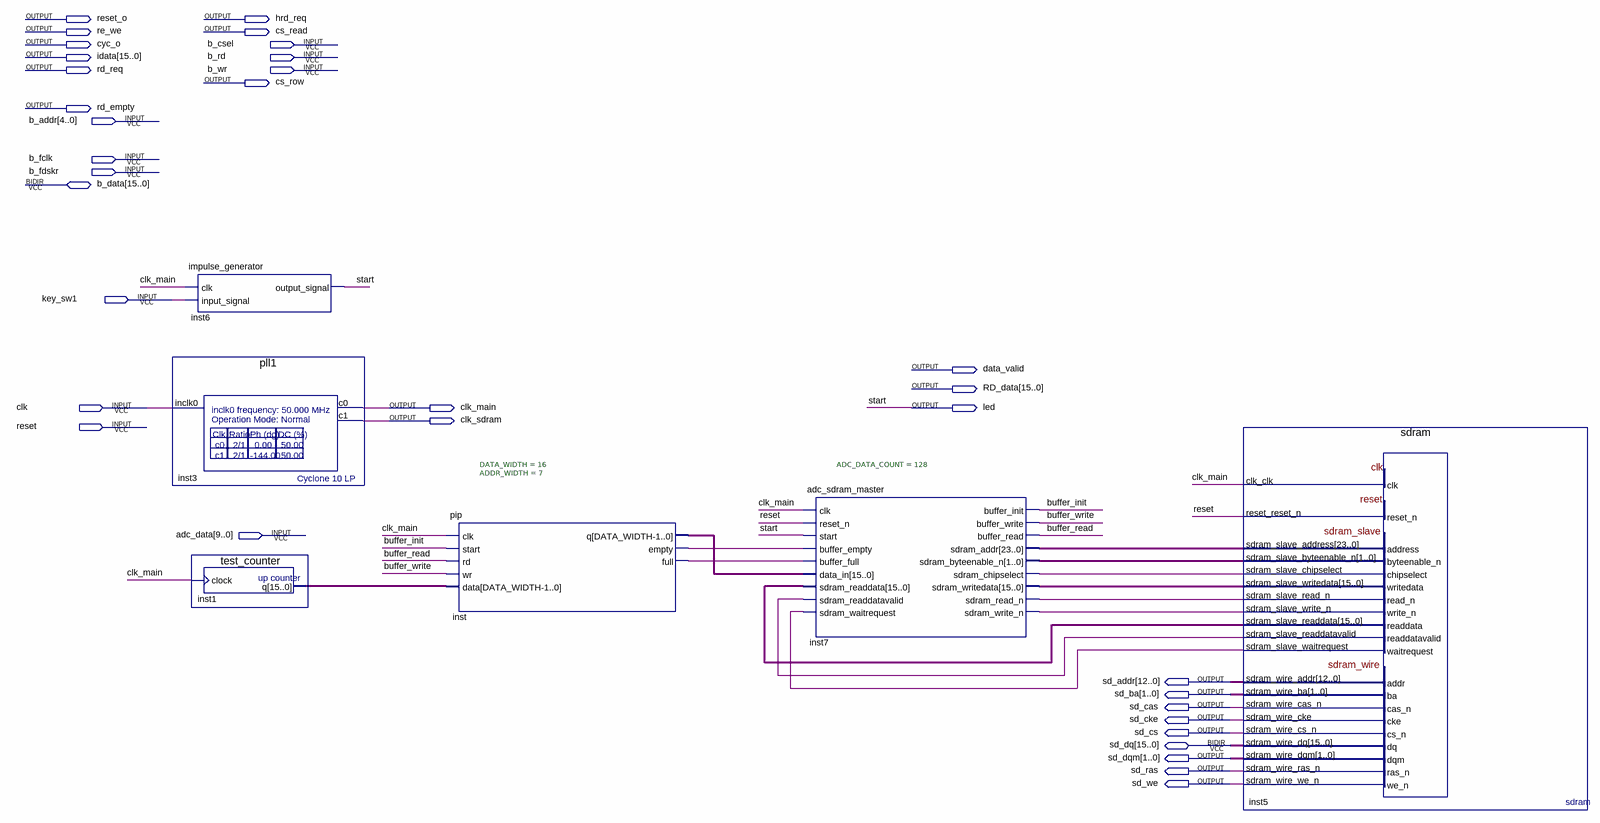
[diagram p0: schematic sheet]
// Quartus schematic burst.bdf as structural Verilog: 6 symbols, 34 pins
module burst (
  input  b_csel,
  input  b_rd,
  input  b_wr,
  input  [4:0] b_addr,
  input  b_fclk,
  input  b_fdskr,
  input  key_sw1,
  input  clk,
  input  reset,
  input  [9:0] adc_data,
  inout  [15:0] b_data,
  inout  [15:0] sd_dq,
  output reset_o,
  output hrd_req,
  output re_we,
  output cs_read,
  output cyc_o,
  output [15:0] idata,
  output rd_req,
  output cs_row,
  output rd_empty,
  output data_valid,
  output [15:0] RD_data,
  output clk_main,
  output led,
  output clk_sdram,
  output [12:0] sd_addr,
  output [1:0] sd_ba,
  output sd_cas,
  output sd_cke,
  output sd_cs,
  output [1:0] sd_dqm,
  output sd_ras,
  output sd_we
);

  wire buffer_init, buffer_read, buffer_write, inst5_sdram_slave_readdatavalid,
       inst5_sdram_slave_waitrequest, inst7_sdram_chipselect, inst7_sdram_read_n, inst7_sdram_write_n,
       inst_empty, inst_full;
  wire [1:0] inst7_sdram_byteenable_n;
  wire [15:0] inst1_q, inst5_sdram_slave_readdata, inst7_sdram_writedata, inst_q;
  wire [23:0] inst7_sdram_addr;

  impulse_generator inst6 (.clk(clk_main), .input_signal(key_sw1), .output_signal(led));
  pll1 inst3 (.inclk0(clk), .c0(clk_main), .c1(clk_sdram));
  test_counter inst1 (.clock(clk_main), .q(inst1_q));
  pip #(.DATA_WIDTH(16), .ADDR_WIDTH(7)) inst (
    .clk(clk_main), .start(buffer_init), .rd(buffer_read), .wr(buffer_write), .data(inst1_q), .q(inst_q),
    .empty(inst_empty), .full(inst_full));
  adc_sdram_master #(.ADC_DATA_COUNT(128)) inst7 (
    .clk(clk_main), .reset_n(reset), .start(led), .buffer_empty(inst_empty), .buffer_full(inst_full),
    .data_in(inst_q), .sdram_readdata(inst5_sdram_slave_readdata),
    .sdram_readdatavalid(inst5_sdram_slave_readdatavalid), .sdram_waitrequest(inst5_sdram_slave_waitrequest),
    .buffer_init(buffer_init), .buffer_write(buffer_write), .buffer_read(buffer_read),
    .sdram_addr(inst7_sdram_addr), .sdram_byteenable_n(inst7_sdram_byteenable_n),
    .sdram_chipselect(inst7_sdram_chipselect), .sdram_writedata(inst7_sdram_writedata),
    .sdram_read_n(inst7_sdram_read_n), .sdram_write_n(inst7_sdram_write_n));
  sdram inst5 (
    .clk_clk(clk_main), .reset_reset_n(reset), .sdram_slave_address(inst7_sdram_addr),
    .sdram_slave_byteenable_n(inst7_sdram_byteenable_n), .sdram_slave_chipselect(inst7_sdram_chipselect),
    .sdram_slave_writedata(inst7_sdram_writedata), .sdram_slave_read_n(inst7_sdram_read_n),
    .sdram_slave_write_n(inst7_sdram_write_n), .sdram_slave_readdata(inst5_sdram_slave_readdata),
    .sdram_slave_readdatavalid(inst5_sdram_slave_readdatavalid),
    .sdram_slave_waitrequest(inst5_sdram_slave_waitrequest), .sdram_wire_addr(sd_addr),
    .sdram_wire_ba(sd_ba), .sdram_wire_cas_n(sd_cas), .sdram_wire_cke(sd_cke), .sdram_wire_cs_n(sd_cs),
    .sdram_wire_dqm(sd_dqm), .sdram_wire_ras_n(sd_ras), .sdram_wire_we_n(sd_we), .sdram_wire_dq(sd_dq));

  // Other names for the same wires on the sheet: start = led
endmodule
